# Altium schematic sheet Ant.SchDoc
size A2
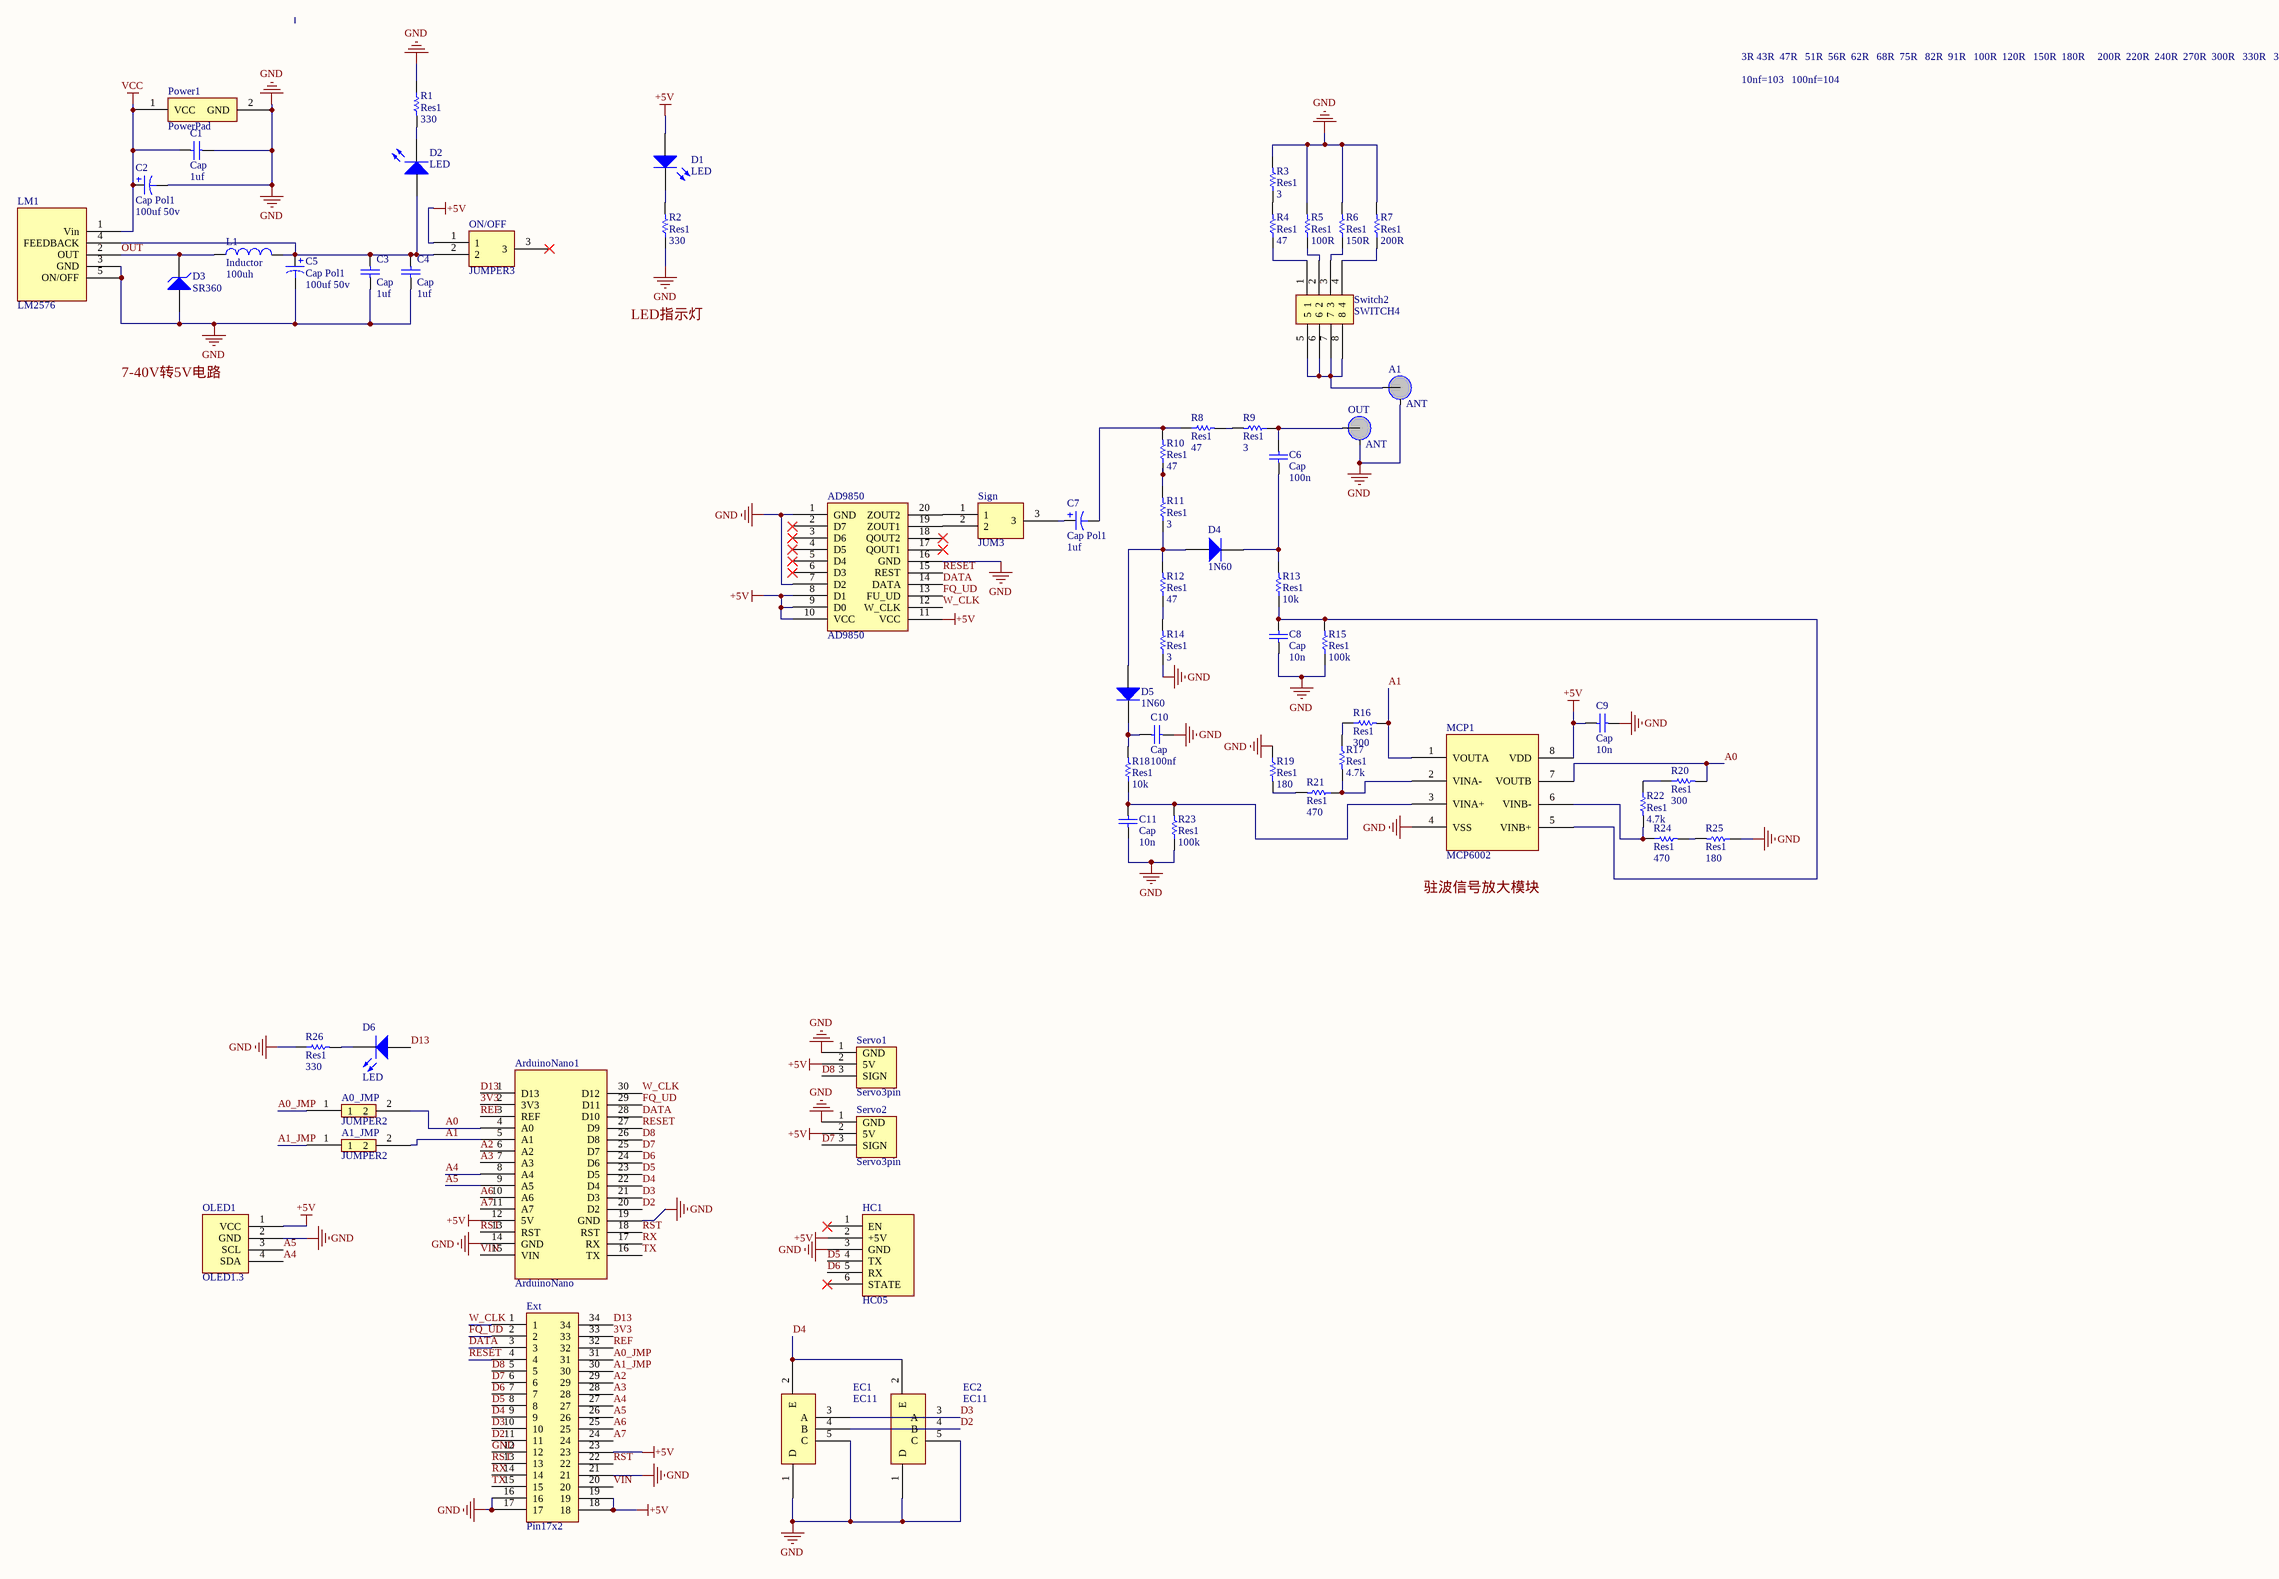
[diagram p0: Ant.SchDoc]

## Parts
A0_JMP  JUMPER2  [PIN2]
A1  ANT  [SMA]
A1_JMP  JUMPER2  [PIN2]
AD9850  AD9850  [AD9850]
ArduinoNano1  ArduinoNano  [ArduinoNano]
C1  Cap  value 1uf  [C0805]
C2  Cap Pol1  value 100uf 50v  [C08105]
C3  Cap  value 1uf  [C0805]
C4  Cap  value 1uf  [C0805]
C5  Cap Pol1  value 100uf 50v  [C08105]
C6  Cap  value 100n  [C1206]
C7  Cap Pol1  value 1uf  [C5X5.4]
C8  Cap  value 10n  [C1206]
C9  Cap  value 10n  [C1206]
C10  Cap  value 100nf  [C1206]
C11  Cap  value 10n  [C1206]
D1  LED  [LED0805]
D2  LED  [LED0805]
D3  SR360  [SR360]
D4  1N60  [1N60]
D5  1N60  [1N60]
D6  LED  [LED0805]
EC1  EC11  [PIN5]
EC2  EC11  [EC11]
Ext  Pin17x2  [Pin17x2]
HC1  HC05  [PIN6]
L1  Inductor  value 100uh  [L12127]
LM1  LM2576
MCP1  MCP6002  [MCP6002]
OLED1  OLED1.3  [PIN4]
ON/OFF  JUMPER3  [SWITCH]
OUT  ANT  [PAD2]
Power1  PowerPad  [Power3pin]
R1  Res1  value 330  [r0805]
R2  Res1  value 330  [r0805]
R3  Res1  value 3  [R1206]
R4  Res1  value 47  [R1206]
R5  Res1  value 100R  [R1206]
R6  Res1  value 150R  [R1206]
R7  Res1  value 200R  [R1206]
R8  Res1  value 47  [R1206]
R9  Res1  value 3  [R1206]
R10  Res1  value 47  [R1206]
R11  Res1  value 3  [R1206]
R12  Res1  value 47  [R1206]
R13  Res1  value 10k  [R1206]
R14  Res1  value 3  [R1206]
R15  Res1  value 100k  [R1206]
R16  Res1  value 300  [R1206]
R17  Res1  value 4.7k  [R1206]
R18  Res1  value 10k  [R1206]
R19  Res1  value 180  [R1206]
R20  Res1  value 300  [R1206]
R21  Res1  value 470  [R1206]
R22  Res1  value 4.7k  [R1206]
R23  Res1  value 100k  [R1206]
R24  Res1  value 470  [R1206]
R25  Res1  value 180  [R1206]
R26  Res1  value 330  [r0805]
Servo1  Servo3pin  [PIN3]
Servo2  Servo3pin  [PIN3]
Sign  JUM3  [SWITCH3]
Switch2  SWITCH4  [SWITCH4]

## Nets
+5V: AD9850.8(D1) AD9850.9(D0) AD9850.10(VCC) AD9850.11(VCC) ArduinoNano1.12(5V) C9.1 D1.1(A) Ext.18 Ext.19 Ext.23 HC1.2(+5V) MCP1.8(VDD) OLED1.1(VCC) ON/OFF.1 Servo1.2(5V) Servo2.2(5V)
GND: A1.2 AD9850.1(GND) AD9850.7(D2) AD9850.16(GND) ArduinoNano1.14(GND) ArduinoNano1.19(GND) C1.2 C2.2 C3.2 C4.2 C5.2 C8.2 C9.2 C10.2 C11.1 D3.1(A) EC1.1(D) EC1.5(C) EC2.1(D) EC2.5(C) Ext.12 Ext.16 Ext.17 Ext.21 HC1.3(GND) LM1.3(GND) LM1.5(ON/OFF) MCP1.4(VSS) OLED1.2(GND) OUT.2 Power1.2(GND) R1.1 R2.1 R3.2 R5.2 R6.2 R7.2 R14.1 R15.1 R19.1 R23.1 R25.1 R26.1 Servo1.1(GND) Servo2.1(GND)
VCC: C1.1 C2.1 LM1.1(Vin) Power1.1(VCC)
3V3: ArduinoNano1.2(3V3) Ext.33
A0: A0_JMP.2 ArduinoNano1.4(A0) MCP1.7(VOUTB) R20.2
A0_JMP: A0_JMP.1 Ext.31
A1: A1_JMP.2 ArduinoNano1.5(A1) MCP1.1(VOUTA) R16.2
A1_JMP: A1_JMP.1 Ext.30
A2: ArduinoNano1.6(A2) Ext.29
A3: ArduinoNano1.7(A3) Ext.28
A4: ArduinoNano1.8(A4) Ext.27 OLED1.4(SDA)
A5: ArduinoNano1.9(A5) Ext.26 OLED1.3(SCL)
A6: ArduinoNano1.10(A6) Ext.25
A7: ArduinoNano1.11(A7) Ext.24
D2: ArduinoNano1.20(D2) EC1.4(B) EC2.4(B) Ext.11
D3: ArduinoNano1.21(D3) EC1.3(A) EC2.3(A) Ext.10
D4: ArduinoNano1.22(D4) EC1.2(E) EC2.2(E) Ext.9
D5: ArduinoNano1.23(D5) Ext.8 HC1.4(TX)
D6: ArduinoNano1.24(D6) Ext.7 HC1.5(RX)
D7: ArduinoNano1.25(D7) Ext.6 Servo2.3(SIGN)
D8: ArduinoNano1.26(D8) Ext.5 Servo1.3(SIGN)
D13: ArduinoNano1.1(D13) D6.1(A) Ext.34
DATA: AD9850.14(DATA) ArduinoNano1.28(D10) Ext.3
FQ_UD: AD9850.13(FU_UD) ArduinoNano1.29(D11) Ext.2
OUT: D3.2(K) L1.1 LM1.2(OUT)
REF: ArduinoNano1.3(REF) Ext.32
RESET: AD9850.15(REST) ArduinoNano1.27(D9) Ext.4
RST: ArduinoNano1.13(RST) ArduinoNano1.18(RST) Ext.13 Ext.22
RX: ArduinoNano1.17(RX) Ext.14
TX: ArduinoNano1.16(TX) Ext.15
VIN: ArduinoNano1.15(VIN) Ext.20
W_CLK: AD9850.12(W_CLK) ArduinoNano1.30(D12) Ext.1
NetA1_1: A1.1 Switch2.5 Switch2.6 Switch2.7 Switch2.8
NetAD9850_19: AD9850.19(ZOUT1) Sign.2
NetAD9850_20: AD9850.20(ZOUT2) Sign.1
NetC3_1: C3.1 C4.1 C5.1 D2.1(A) L1.2 LM1.4(FEEDBACK) ON/OFF.2
NetC6_1: C6.1 OUT.1 R9.1
NetC6_2: C6.2 D4.2(K) R13.2
NetC7_1: C7.1 Sign.3
NetC7_2: C7.2 R8.1 R10.2
NetC8_1: C8.1 MCP1.5(VINB+) R13.1 R15.2
NetC10_1: C10.1 D5.2(K) R18.2
NetC11_2: C11.2 MCP1.3(VINA+) R18.1 R23.2
NetD1_2: D1.2(K) R2.2
NetD2_2: D2.2(K) R1.2
NetD4_1: D4.1(A) D5.1(A) R11.1 R12.2
NetD6_2: D6.2(K) R26.2
NetMCP1_2: MCP1.2(VINA-) R17.2 R21.1
NetMCP1_6: MCP1.6(VINB-) R22.2 R24.1
NetR3_1: R3.1 R4.2
NetR4_1: R4.1 Switch2.1
NetR5_1: R5.1 Switch2.2
NetR6_1: R6.1 Switch2.3
NetR7_1: R7.1 Switch2.4
NetR8_2: R8.2 R9.2
NetR10_1: R10.1 R11.2
NetR12_1: R12.1 R14.2
NetR16_1: R16.1 R17.1
NetR19_2: R19.2 R21.2
NetR20_1: R20.1 R22.1
NetR24_2: R24.2 R25.2

Not connected (* = marked no-connect by the designer): AD9850 2(D7)* 3(D6)* 4(D5)* 5(D4)* 6(D3)* 17(QOUT1)* 18(QOUT2)*; HC1 1(EN)* 6(STATE)*; ON/OFF 3*

## Notes on the sheet
- 3R 43R  47R   51R  56R  62R   68R  75R   82R  91R   100R  120R   150R  180R     200R  220R  240R  270R  300R   330R   360R  390R  430R  470R  510R   560R   4.7k
- 10nf=103   100nf=104
- LED指示灯
- 7-40V转5V电路
- 驻波信号放大模块

## Library data of the parts
C1 C3 C4 C6 C8-C11 = Cap: Capacitor; Published: 8-Jun-2000; LatestRevisionDate: 17-Jul-2002; LatestRevisionNote: Re-released for DXP Platform.; PackageReference: RAD-0.3; Publisher: Altium Limited; PackageDescription: Radial Cap, Thru-Hole; 2 Leads; 0.3 in Pin Spacing
C2 C5 C7 = Cap Pol1: Polarized Capacitor (Radial); Published: 8-Jun-2000; LatestRevisionDate: 17-Jul-2002; LatestRevisionNote: Re-released for DXP Platform.; PackageReference: RB7.6-15; Publisher: Altium Limited; PackageDescription: Polarized Capacitor (Radial); 2 Leads
D1 D2 D6 = LED0: Typical INFRARED GaAs LED; Published: 8-Jun-2000; LatestRevisionDate: 08-Jul-2005; LatestRevisionNote: Mech Layer 1 removed.; PackageReference: LED-0; Publisher: Altium Limited; PackageDescription: LED; 2 Leads
D3 = D Zener: Zener Diode; Published: 8-Jun-2000; LatestRevisionDate: 17-Jul-2002; LatestRevisionNote: Re-released for DXP Platform.; PackageReference: DIODE-0.7; Publisher: Altium Limited; PackageDescription: Diode, Thru-Hole; 2 Leads; 0.7 in Pin Spacing
D4 D5 = Diode: Default Diode; Published: 8-Jun-2000; LatestRevisionDate: 17-Jul-2002; LatestRevisionNote: Re-released for DXP Platform.; PackageVersion: Sep-1996; PackageReference: SMC; Publisher: Altium Limited; PackageDescription: DO-214-AB/SMC; 2 C-Bend Leads; Body 7.9 x 5.9 mm, inc. leads (LxW); Code_JEDEC: DO-214-AB
L1 = Inductor: Code_IEC: 1005; Published: 8-Jun-2000; LatestRevisionDate: 29-May-2009; LatestRevisionNote: IPC-7351 Footprint Added.; PackageReference: 0402-A; Publisher: Altium Limited; PackageDescription: Chip Inductor; Code_JEITA: 0402
R1-R26 = Res1: Resistor; Published: 8-Jun-2000; LatestRevisionDate: 17-Jul-2002; LatestRevisionNote: Re-released for DXP Platform.; PackageReference: AXIAL-0.3; Publisher: Altium Limited; PackageDescription: Axial Device, Thru-Hole; 2 Leads; 0.3 in Pin Spacing